# Altium project project_10.PrjPcb
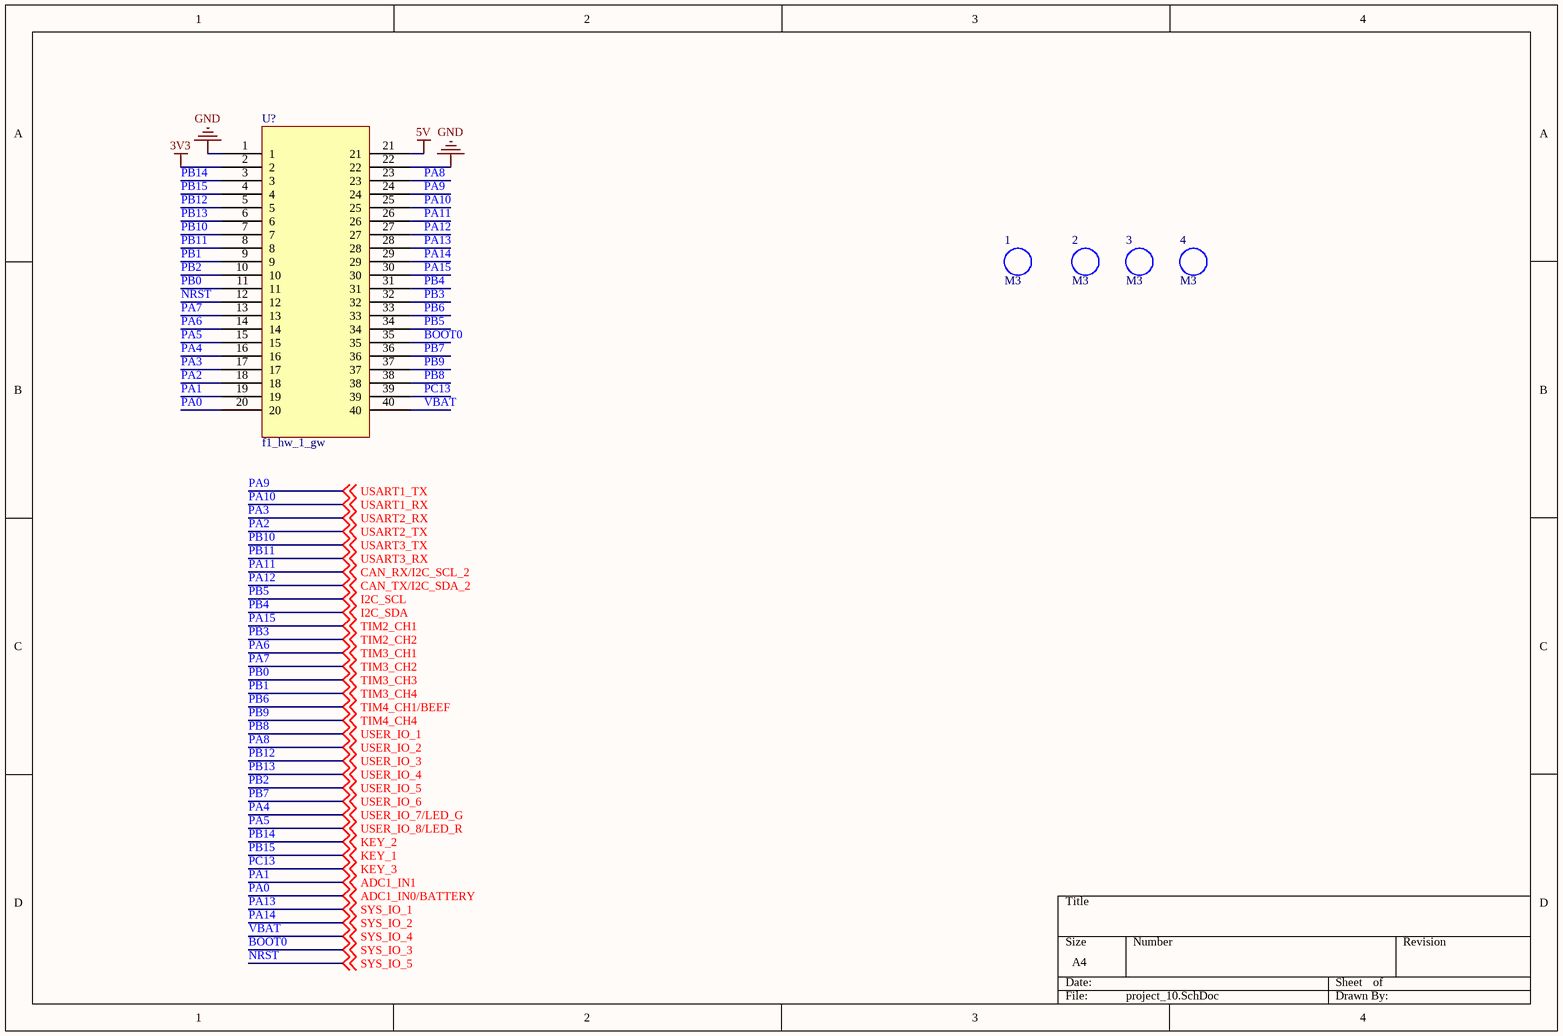
[diagram p0: project_10.SchDoc]
1 sheet, 5 parts. Net scope: global (net labels, ports and power ports of the same name join across sheets).
Board file: project_10.PcbDoc

## Sheet project_10.SchDoc
size A4; SheetNumber: 1; SheetTotal: 1

### Parts
1  M3  [M3 125X200]
2  M3  [M3 125X200]
3  M3  [M3 125X200]
4  M3  [M3 125X200]
U?  f1_hw_1_gw  [F1_HW_1_GW]

### Nets
3V3: U?.2
5V: U?.21
GND: U?.1 U?.22
BOOT0: U?.35 ; off-sheet SYS_IO_3  [also labelled SYS_IO_3]
NRST: U?.12 ; off-sheet SYS_IO_5  [also labelled SYS_IO_5]
PA0: U?.20 ; off-sheet ADC1_IN0/BATTERY  [also labelled ADC1_IN0/BATTERY]
PA1: U?.19 ; off-sheet ADC1_IN1  [also labelled ADC1_IN1]
PA2: U?.18 ; off-sheet USART2_TX  [also labelled USART2_TX]
PA3: U?.17 ; off-sheet USART2_RX  [also labelled USART2_RX]
PA4: U?.16 ; off-sheet USER_IO_7/LED_G  [also labelled USER_IO_7/LED_G]
PA5: U?.15 ; off-sheet USER_IO_8/LED_R  [also labelled USER_IO_8/LED_R]
PA6: U?.14 ; off-sheet TIM3_CH1  [also labelled TIM3_CH1]
PA7: U?.13 ; off-sheet TIM3_CH2  [also labelled TIM3_CH2]
PA8: U?.23 ; off-sheet USER_IO_2  [also labelled USER_IO_2]
PA9: U?.24 ; off-sheet USART1_TX  [also labelled USART1_TX]
PA10: U?.25 ; off-sheet USART1_RX  [also labelled USART1_RX]
PA11: U?.26 ; off-sheet CAN_RX/I2C_SCL_2  [also labelled CAN_RX/I2C_SCL_2]
PA12: U?.27 ; off-sheet CAN_TX/I2C_SDA_2  [also labelled CAN_TX/I2C_SDA_2]
PA13: U?.28 ; off-sheet SYS_IO_1  [also labelled SYS_IO_1]
PA14: U?.29 ; off-sheet SYS_IO_2  [also labelled SYS_IO_2]
PA15: U?.30 ; off-sheet TIM2_CH1  [also labelled TIM2_CH1]
PB0: U?.11 ; off-sheet TIM3_CH3  [also labelled TIM3_CH3]
PB1: U?.9 ; off-sheet TIM3_CH4  [also labelled TIM3_CH4]
PB2: U?.10 ; off-sheet USER_IO_5  [also labelled USER_IO_5]
PB3: U?.32 ; off-sheet TIM2_CH2  [also labelled TIM2_CH2]
PB4: U?.31 ; off-sheet I2C_SDA  [also labelled I2C_SDA]
PB5: U?.34 ; off-sheet I2C_SCL  [also labelled I2C_SCL]
PB6: U?.33 ; off-sheet TIM4_CH1/BEEF  [also labelled TIM4_CH1/BEEF]
PB7: U?.36 ; off-sheet USER_IO_6  [also labelled USER_IO_6]
PB8: U?.38 ; off-sheet USER_IO_1  [also labelled USER_IO_1]
PB9: U?.37 ; off-sheet TIM4_CH4  [also labelled TIM4_CH4]
PB10: U?.7 ; off-sheet USART3_TX  [also labelled USART3_TX]
PB11: U?.8 ; off-sheet USART3_RX  [also labelled USART3_RX]
PB12: U?.5 ; off-sheet USER_IO_3  [also labelled USER_IO_3]
PB13: U?.6 ; off-sheet USER_IO_4  [also labelled USER_IO_4]
PB14: U?.3 ; off-sheet KEY_2  [also labelled KEY_2]
PB15: U?.4 ; off-sheet KEY_1  [also labelled KEY_1]
PC13: U?.39 ; off-sheet KEY_3  [also labelled KEY_3]
VBAT: U?.40 ; off-sheet SYS_IO_4  [also labelled SYS_IO_4]

### Library data of the parts
1-4 = prot_m3: m3铜柱孔; BOM名称: 铜柱孔; 版权归属: 源创客; 学习资源: www.ooocke.com